# Altium schematic sheet Keyfinder_MCU.SchDoc: Keyfinder MCU and nRF24L01+
size A4; DrawnBy: M. Schwegler; Organization: HSLU T&A; Address1: Abteilung Elektrotechnik; Address2: Technikumsstrasse 21; Address3: CH-6048 Horw; Revision: v2; SheetNumber: 2; SheetTotal: 4; Projektname: SmartBoard
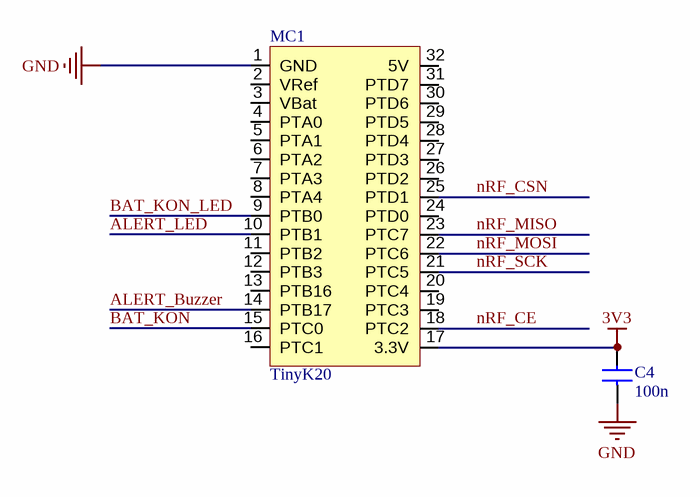
[diagram p0: Keyfinder_MCU.SchDoc]

## Parts
C4  100n  [0805_C]
MC1  TinyK20  [DIP32]

## Nets
3V3: C4.2 MC1.17(3.3V)
GND: C4.1 MC1.1(GND)
ALERT_Buzzer: MC1.14(PTB17)
ALERT_LED: MC1.10(PTB1)
BAT_KON: MC1.15(PTC0)
BAT_KON_LED: MC1.9(PTB0)
nRF_CE: MC1.18(PTC2)
nRF_CSN: MC1.25(PTD1)
nRF_MISO: MC1.23(PTC7)
nRF_MOSI: MC1.22(PTC6)
nRF_SCK: MC1.21(PTC5)

Not connected (* = marked no-connect by the designer): MC1 2(VRef) 3(VBat) 4(PTA0) 5(PTA1) 6(PTA2) 7(PTA3) 8(PTA4) 11(PTB2) 12(PTB3) 13(PTB16) 16(PTC1) 19(PTC3) 20(PTC4) 24(PTD0) 26(PTD2) 27(PTD3) 28(PTD4) 29(PTD5) 30(PTD6) 31(PTD7) 32(5V)

## Notes on the sheet
- Project:
- Drawn by:
- Size:
- Sheet
- A4
- Rev.:
- of
- Date:
- File:

## Library data of the parts
C4 = C?: Normaler Kondensator